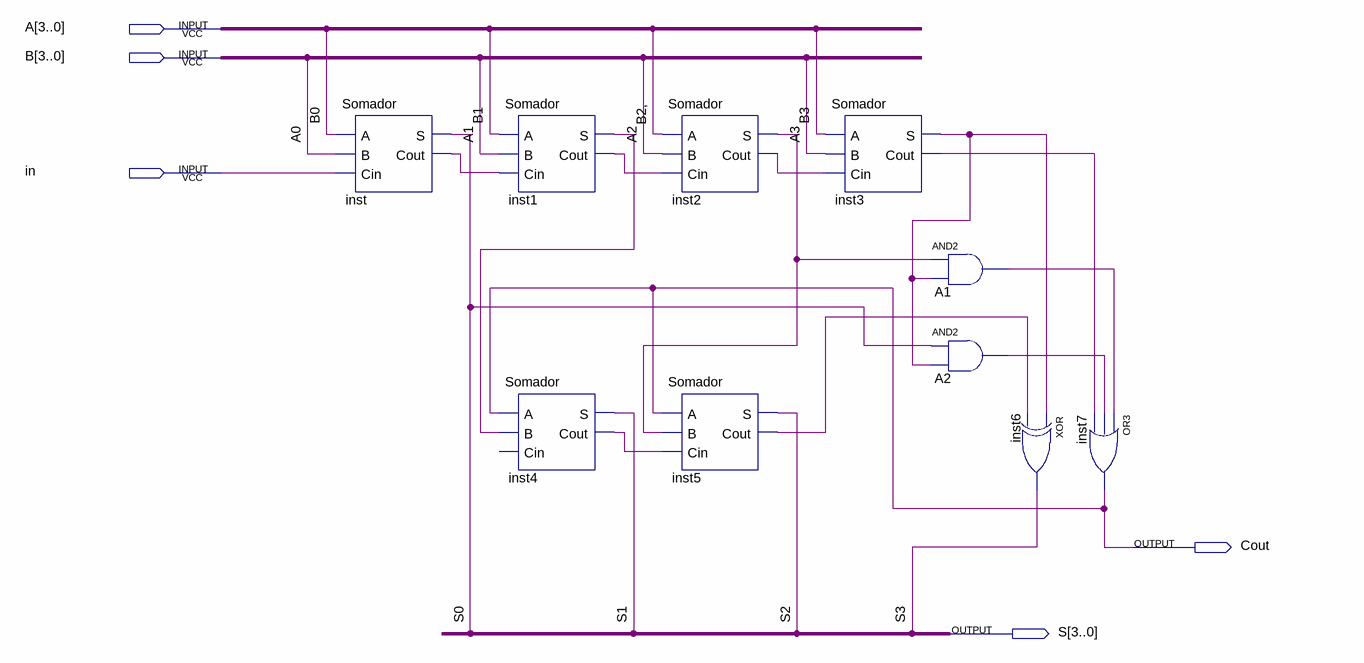
[diagram p0: schematic sheet]
// Quartus schematic SomadorBCD.bdf as structural Verilog: 10 symbols, 5 pins
module SomadorBCD (
  input  [3:0] A,
  input  [3:0] B,
  input  in,
  output Cout,
  output [3:0] S
);

  wire A1_out, A2_out, inst1_cout, inst1_s, inst2_cout, inst2_s, inst3_cout, inst3_s, inst4_cout, inst5_cout,
       inst_cout, undriven;

  Somador inst (.A(B[0]), .B(A[0]), .Cin(in), .S(S[0]), .Cout(inst_cout));
  Somador inst1 (.A(B[1]), .B(A[1]), .Cin(inst_cout), .S(inst1_s), .Cout(inst1_cout));
  Somador inst4 (.A(Cout), .B(inst1_s), .S(S[1]), .Cout(inst4_cout));  // open: Cin
  Somador inst2 (.A(undriven), .B(A[2]), .Cin(inst1_cout), .S(inst2_s), .Cout(inst2_cout));
  Somador inst5 (.A(Cout), .B(inst2_s), .Cin(inst4_cout), .S(S[2]), .Cout(inst5_cout));
  Somador inst3 (.A(B[3]), .B(A[3]), .Cin(inst2_cout), .S(inst3_s), .Cout(inst3_cout));
  and A1 (A1_out, inst2_s, inst3_s);
  and A2 (A2_out, S[0], inst3_s);
  xor inst6 (S[3], inst3_s, inst5_cout);
  or inst7 (Cout, A1_out, A2_out, inst3_cout);
endmodule
